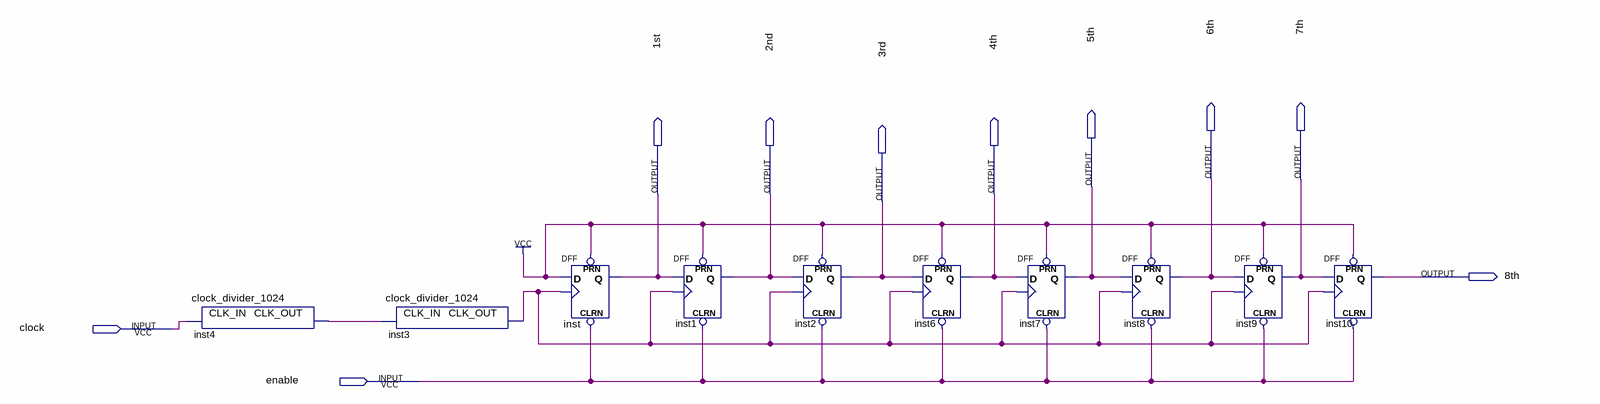
[diagram p0: schematic sheet]
// Quartus schematic CountUp.bdf as structural Verilog: 10 symbols, 10 pins
module CountUp (
  input  clock,
  input  enable,
  output \6th ,
  output \7th ,
  output \5th ,
  output \1st ,
  output \2nd ,
  output \4th ,
  output \3rd ,
  output \8th 
);

  wire inst3_clk_out, inst4_clk_out;

  clock_divider_1024 inst4 (.CLK_IN(clock), .CLK_OUT(inst4_clk_out));
  clock_divider_1024 inst3 (.CLK_IN(inst4_clk_out), .CLK_OUT(inst3_clk_out));
  DFF inst (.CLRN(enable), .CLK(inst3_clk_out), .D(1'b1), .PRN(1'b1), .Q(\1st ));
  DFF inst1 (.CLRN(enable), .CLK(inst3_clk_out), .D(\1st ), .PRN(1'b1), .Q(\2nd ));
  DFF inst2 (.CLRN(enable), .CLK(inst3_clk_out), .D(\2nd ), .PRN(1'b1), .Q(\3rd ));
  DFF inst6 (.CLRN(enable), .CLK(inst3_clk_out), .D(\3rd ), .PRN(1'b1), .Q(\4th ));
  DFF inst7 (.CLRN(enable), .CLK(inst3_clk_out), .D(\4th ), .PRN(1'b1), .Q(\5th ));
  DFF inst8 (.CLRN(enable), .CLK(inst3_clk_out), .D(\5th ), .PRN(1'b1), .Q(\6th ));
  DFF inst9 (.CLRN(enable), .CLK(inst3_clk_out), .D(\6th ), .PRN(1'b1), .Q(\7th ));
  DFF inst10 (.CLRN(enable), .CLK(inst3_clk_out), .D(\7th ), .PRN(1'b1), .Q(\8th ));
endmodule
